# EAGLE design untitled (EAGLE 6.5.0)
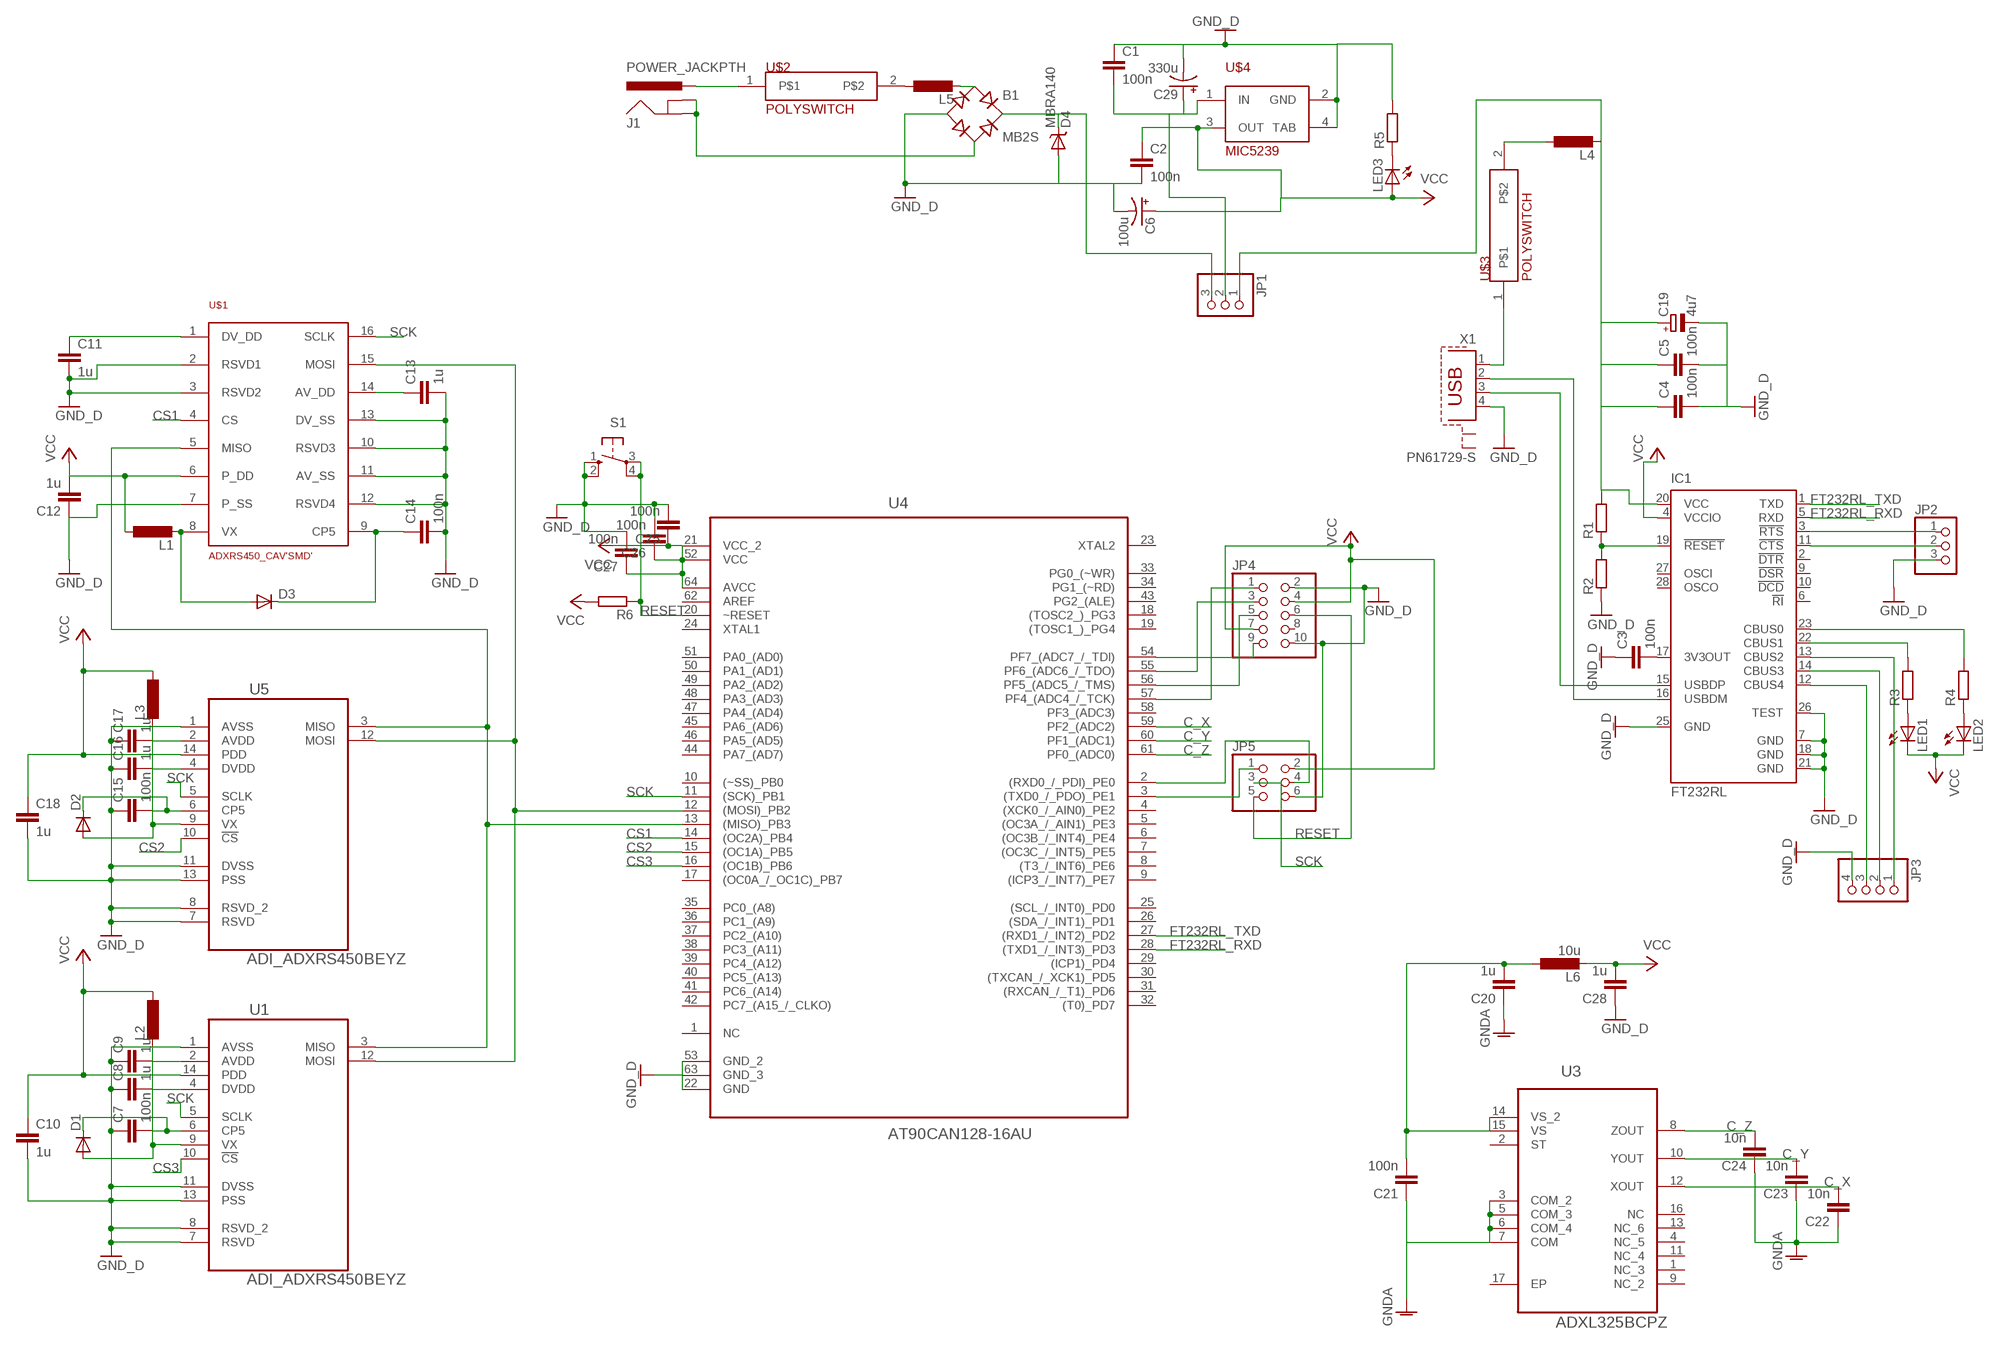
[diagram p0: schematic, sheet 1]

## Parts
B1  MB2S  [SOIC-4]
C1  100n  CAP0603-CAP  [0603-CAP]
C2  100n  CAP0603-CAP  [0603-CAP]
C3  100n  CAP0603-CAP  [0603-CAP]
C4  100n  C-EUC0603  [C0603]
C5  100n  C-EUC0603  [C0603]
C6  100u  CAP_POLG  [PANASONIC_G]
C7  100n  C-EUC0603  [C0603]
C8  1u  C-EUC0603  [C0603]
C9  1u  C-EUC0603  [C0603]
C10  1u  C-EUC0603  [C0603]
C11  1u  C-EUC0603  [C0603]
C12  1u  C-EUC0603  [C0603]
C13  1u  C-EUC0603  [C0603]
C14  100n  C-EUC0603  [C0603]
C15  100n  C-EUC0603  [C0603]
C16  1u  C-EUC0603  [C0603]
C17  1u  C-EUC0603  [C0603]
C18  1u  C-EUC0603  [C0603]
C19  4u7  CPOL-EU153CLV-0405  [153CLV-0405]
C20  1u  C-EUC0603  [C0603]
C21  100n  C-EUC0603  [C0603]
C22  10n  C-EUC0603  [C0603]
C23  10n  C-EUC0603  [C0603]
C24  10n  C-EUC0603  [C0603]
C25  100n  C-EUC0603  [C0603]
C26  100n  C-EUC0603  [C0603]
C27  100n  C-EUC0603  [C0603]
C28  1u  C-EUC0603  [C0603]
C29  330u  CAP_POLG  [PANASONIC_G]
D1  DIODE-SOD123  [SOD123]
D2  DIODE-SOD123  [SOD123]
D3  DIODE-SOD123  [SOD123]
D4  MBRA140  [SMA-DIODE]
IC1  FT232RL  [SSOP28]
J1  POWER_JACKPTH  [POWER_JACK_PTH]
JP1  PINHD-1X3  [1X03]
JP2  PINHD-1X3  [1X03]
JP3  PINHD-1X4  [1X04]
JP4  PINHD-2X5  [2X05]
JP5  PINHD-2X3  [2X03]
L1  L-EUL1812  [L1812]
L2  L-EUL1812  [L1812]
L3  L-EUL1812  [L1812]
L4  L-EUL1812  [L1812]
L5  L-EUL1812  [L1812]
L6  10u  L-EUL1812  [L1812]
LED1  LEDCHIPLED_0603  [CHIPLED_0603]
LED2  LEDCHIPLED_0603  [CHIPLED_0603]
LED3  LEDCHIPLED_0603  [CHIPLED_0603]
R1  R-EU_R0603  [R0603]
R2  R-EU_R0603  [R0603]
R3  R-EU_R0603  [R0603]
R4  R-EU_R0603  [R0603]
R5  R-EU_R0603  [R0603]
R6  R-EU_R0603  [R0603]
S1  10-XX  [B3F-10XX]
U1  ADI_ADXRS450BEYZ  [ADI_ADXRS45XXXX]
U3  ADXL325BCPZ  [QFN65P400X400X150-17N]
U4  AT90CAN128-16AU  [QFP80P1600X1600X120-64N]
U5  ADI_ADXRS450BEYZ  [ADI_ADXRS45XXXX]
U$1  ADXRS450_CAV'SMD'  [SOIC_CAV_16]
U$2  POLYSWITCH  [FUSE]
U$3  POLYSWITCH  [FUSE]
U$4  MIC5239  [SOT-223-3]
X1  PN61729-S  [PN61729-S]

## Nets
C_X: C22.2 U3.12(XOUT) U4.59(PF2_(ADC2))
C_Y: C23.2 U3.10(YOUT) U4.60(PF1_(ADC1))
C_Z: C24.2 U3.8(ZOUT) U4.61(PF0_(ADC0))
CS1: U4.14((OC2A)_PB4) U$1.4(CS)
CS2: U4.15((OC1A)_PB5) U5.10(!CS)
CS3: U1.10(!CS) U4.16((OC1B)_PB6)
FT232RL_RXD: IC1.5(RXD) U4.28((TXD1_/_INT3)_PD3)
FT232RL_TXD: IC1.1(TXD) U4.27((RXD1_/_INT2)_PD2)
GND: B1.- C1.1 C2.2 C3.1 C4.2 C5.2 C6.- C7.1 C8.1 C9.1 C10.2 C11.2 C12.1 C13.2 C14.2 C15.1 C16.1 C17.1 C18.2 C19.- C25.2 C26.2 C27.2 C28.1 C29.- D4.A IC1.7(GND) IC1.18(GND) IC1.21(GND) IC1.25(GND) IC1.26(TEST) JP2.3 JP3.4 JP4.2 JP4.10 JP5.6 R2.1 R5.2 S1.1(S) S1.2(S1) U1.1(AVSS) U1.7(RSVD) U1.8(RSVD_2) U1.11(DVSS) U1.13(PSS) U4.22(GND) U4.53(GND_2) U5.1(AVSS) U5.7(RSVD) U5.8(RSVD_2) U5.11(DVSS) U5.13(PSS) U$1.2(RSVD1) U$1.3(RSVD2) U$1.7(P_SS) U$1.10(RSVD3) U$1.11(AV_SS) U$1.12(RSVD4) U$1.13(DV_SS) U$4.2(GND) U$4.4(TAB) X1.4 ; supply symbol labelled GND_D
GNDA: C20.1 C21.1 C22.1 C23.1 C24.1 U3.3(COM_2) U3.5(COM_3) U3.6(COM_4) U3.7(COM)
N$1: J1.PWR U$2.1
N$2: L5.1 U$2.2
N$3: B1.~2(AC2) J1.GND J1.GNDBREAK
N$4: C1.2 C29.+ JP1.2 U$4.1(IN)
N$5: D3.A L1.2 U$1.8(VX)
N$6: JP4.1 U4.57(PF4_(ADC4_/_TCK))
N$7: JP4.3 U4.55(PF6_(ADC6_/_TDO))
N$8: U$3.1 X1.1
N$9: IC1.16(USBDM) X1.2
N$10: C9.2 U1.2(AVDD)
N$11: C8.2 U1.4(DVDD)
N$12: C7.2 D1.C U1.6(CP5)
N$13: C13.1 U$1.14(AV_DD)
N$14: IC1.15(USBDP) X1.3
N$15: C14.1 D3.C U$1.9(CP5)
N$16: C11.1 U$1.1(DV_DD)
N$17: C3.2 IC1.17(3V3OUT)
N$18: IC1.19(!RESET) R1.1 R2.2
N$19: D1.A L2.2 U1.9(VX)
N$20: B1.+ D4.C JP1.3
N$21: LED1.A R3.1
N$22: LED2.A R4.1
N$23: C17.2 U5.2(AVDD)
N$24: C16.2 U5.4(DVDD)
N$25: C15.2 D2.C U5.6(CP5)
N$26: D2.A L3.2 U5.9(VX)
N$27: IC1.22(CBUS1) R3.2
N$28: IC1.23(CBUS0) R4.2
N$29: L4.1 U$3.2
N$30: IC1.3(!RTS) JP2.1
N$31: IC1.11(!CTS) JP2.2
N$32: IC1.13(CBUS2) JP3.1
N$33: JP5.1 U4.3((TXD0_/_PDO)_PE1)
N$34: IC1.14(CBUS3) JP3.2
N$35: IC1.12(CBUS4) JP3.3
N$36: LED3.C R5.1
N$37: B1.~1(AC1) L5.2
N$38: JP5.4 U4.2((RXD0_/_PDI)_PE0)
N$39: JP4.5 U4.56(PF5_(ADC5_/_TMS))
N$40: C4.1 C5.1 C19.+ IC1.20(VCC) JP1.1 L4.2 R1.2
N$41: U1.12(MOSI) U4.12((MOSI)_PB2) U5.12(MOSI) U$1.15(MOSI)
N$44: JP4.9 U4.54(PF7_(ADC7_/_TDI))
N$46: C20.2 C21.2 L6.1 U3.14(VS_2) U3.15(VS)
N$51: U1.3(MISO) U4.13((MISO)_PB3) U5.3(MISO) U$1.5(MISO)
RESET: JP4.6 JP5.5 R6.1 S1.3(P) S1.4(P1) U4.20(~RESET)
SCK: JP5.3 U1.5(SCLK) U4.11((SCK)_PB1) U5.5(SCLK) U$1.16(SCLK)
VCC: C2.1 C6.+ C10.1 C12.2 C18.1 C25.1 C26.1 C27.1 C28.2 IC1.4(VCCIO) JP4.4 JP4.7 JP5.2 L1.1 L2.1 L3.1 L6.2 LED1.C LED2.C LED3.A R6.2 U1.14(PDD) U4.21(VCC_2) U4.64(AVCC) U5.14(PDD) U$1.6(P_DD) U$4.3(OUT)
Unconnected: IC1.2(!DTR) IC1.6(!RI) IC1.9(!DSR) IC1.10(!DCD) IC1.27(OSCI) IC1.28(OSCO) JP4.8 U3.1(NC_3) U3.2(ST) U3.4(NC_5) U3.9(NC_2) U3.11(NC_4) U3.13(NC_6) U3.16(NC) U3.17(EP) U4.1(NC) U4.4((XCK0_/_AIN0)_PE2) U4.5((OC3A_/_AIN1)_PE3) U4.6((OC3B_/_INT4)_PE4) U4.7((OC3C_/_INT5)_PE5) U4.8((T3_/_INT6)_PE6) U4.9((ICP3_/_INT7)_PE7) U4.10((~SS)_PB0) U4.17((OC0A_/_OC1C)_PB7) U4.18((TOSC2_)_PG3) U4.19((TOSC1_)_PG4) U4.23(XTAL2) U4.24(XTAL1) U4.25((SCL_/_INT0)_PD0) U4.26((SDA_/_INT1)_PD1) U4.29((ICP1)_PD4) U4.30((TXCAN_/_XCK1)_PD5) U4.31((RXCAN_/_T1)_PD6) U4.32((T0)_PD7) U4.33(PG0_(~WR)) U4.34(PG1_(~RD)) U4.35(PC0_(A8)) U4.36(PC1_(A9)) U4.37(PC2_(A10)) U4.38(PC3_(A11)) U4.39(PC4_(A12)) U4.40(PC5_(A13)) U4.41(PC6_(A14)) U4.42(PC7_(A15_/_CLKO)) U4.43(PG2_(ALE)) U4.44(PA7_(AD7)) U4.45(PA6_(AD6)) U4.46(PA5_(AD5)) U4.47(PA4_(AD4)) U4.48(PA3_(AD3)) U4.49(PA2_(AD2)) U4.50(PA1_(AD1)) U4.51(PA0_(AD0)) U4.58(PF3_(ADC3)) U4.62(AREF) U4.63(GND_3) X1.S1 X1.S2

## Power pins joined to a net without a drawn wire
VCC: U4.52(VCC)

## Library data of the parts
B1 = rectifier:MB*S: Bridge Rectifier Source: http://www.fairchildsemi.com/ds/MB/MB6S.pdf
C1-C3 = SparkFun-Capacitors:CAP: Capacitor Standard 0603 ceramic capacitor, and 0.1" leaded capacitor.
C4 C5 C7-C18 C20-C28 = rcl:C-EU: CAPACITOR, European symbol
C6 C29 = SparkFun-Capacitors:CAP_POL: Capacitor Polarized These are standard SMD and PTH capacitors. Normally 10uF, 47uF, and 100uF in electrolytic and tantalum varieties. Always verify the external diameter of the through hole cap, it varies with capacity, voltage, and manufacturer. The EIA devices should be standard.
C19 = resistor:CPOL-EU: POLARIZED CAPACITOR, European symbol
D1-D3 = diode:DIODE-: DIODE
D4 = SparkFun-DiscreteSemi:MBRA140: 40V, 1A Schottky rectifier SMA/DO-214AC package DIO-08053; PROD_ID: DIO-08053
IC1 = ftdichip:FT232R: Source: http://www.ftdichip.com/Documents/DataSheets/DS_FT232R_v104.pdf; MPN: FT232RL; OC_FARNELL: 1146032; OC_NEWARK: 91K9918
J1 = SparkFun-Connectors:POWER_JACK: Power Jack This is the standard 5.5mm barrel jack for power. The PTH is the most common, proven, reliable, footprint. The Slot footprint only works if the mill layer is transmitted to the PCB fab house so be warned. Spark Fun Electronics SKU : PRT-00119 SMT: CONN-08106 Mating wall wart : TOL-00298 (and others)
JP1 JP2 = pinhead:PINHD-1X3: PIN HEADER
JP3 = pinhead:PINHD-1X4: PIN HEADER
JP4 = pinhead:PINHD-2X5: PIN HEADER
JP5 = pinhead:PINHD-2X3: PIN HEADER
L1-L6 = rcl:L-EU: INDUCTOR, European symbol
LED1-LED3 = led:LED: LED OSRAM: - CHIPLED LG R971, LG N971, LY N971, LG Q971, LY Q971, LO R971, LY R971 LH N974, LH R974 LS Q976, LO Q976, LY Q976 LO Q996 - Hyper CHIPLED LW Q18S LB Q993, LB Q99A, LB R99A - SideLED LS A670, LO A670, LY A670, LG A670, LP A670 LB A673, LV A673, LT A673, LW A673 LH A674 LY A675 LS A676, LA A676, LO A676, LY A676, LW A676 LS A679, LY A679, LG A679 - Hyper Micro SIDELED® LS Y876, LA Y876, LO Y876, LY Y876 LT Y87S - SmartLED LW L88C, LW L88S LB L89C, LB L89S, LG L890 LS L89K, LO L89K, LY L89K LS L896, LA L896, LO L896, LY L896 - TOPLED LS T670, LO T670, LY T670, LG T670, LP T670 LSG T670, LSP T670, LSY T670, LOP T670, LYG T670 LG T671, LOG T671, LSG T671 LB T673, LV T673, LT T673, LW T673 LH T674 LS T676, LA T676, LO T676, LY T676, LB T676, LH T676, LSB T676, LW T676 LB T67C, LV T67C, LT T67C, LS T67K, LO T67K, LY T67K, LW E67C LS E67B, LA E67B, LO E67B, LY E67B, LB E67C, LV E67C, LT E67C LW T67C LS T679, LY T679, LG T679 LS T770, LO T770, LY T770, LG T770, LP T770 LB T773, LV T773, LT T773, LW T773 LH T774 LS E675, LA E675, LY E675, LS T675 LS T776, LA T776, LO T776, LY T776, LB T776 LHGB T686 LT T68C, LB T68C - Hyper Mini TOPLED® LB M676 - Mini TOPLED Santana® LG M470 LS M47K, LO M47K, LY M47K Source: http://www.osram.convergy.de LUXEON: - LUMILED® LXK2-PW12-R00, LXK2-PW12-S00, LXK2-PW14-U00, LXK2-PW14-V00 LXK2-PM12-R00, LXK2-PM12-S00, LXK2-PM14-U00 LXK2-PE12-Q00, LXK2-PE12-R00, LXK2-PE12-S00, LXK2-PE14-T00, LXK2-PE14-U00 LXK2-PB12-K00, LXK2-PB12-L00, LXK2-PB12-M00, LXK2-PB14-N00, LXK2-PB14-P00, LXK2-PB14-Q00 LXK2-PR12-L00, LXK2-PR12-M00, LXK2-PR14-Q00, LXK2-PR14-R00 LXK2-PD12-Q00, LXK2-PD12-R00, LXK2-PD12-S00 LXK2-PH12-R00, LXK2-PH12-S00 LXK2-PL12-P00, LXK2-PL12-Q00, LXK2-PL12-R00 Source: www.luxeon.com KINGBRIGHT: KA-3528ASYC Source: www.kingbright.com
R1-R6 = rcl:R-EU_: RESISTOR, European symbol
S1 = switch-omron:10-XX: OMRON SWITCH; MPN: B3F-1000; OC_FARNELL: 176432; OC_NEWARK: 36M3542
U1 U5 = ADI-ADL5324_ADXRS45xx:ADI_ADXRS: GYROSCOPE, 300 DEG/SEC, 14LCC; MPN: ADXRS450BEYZ; OC_FARNELL: 1897080; OC_NEWARK: 31T9300; PACKAGE: 14LCC; SUPPLIER: ANALOG DEVICES
U3 = ADXL325:ADXL325BCPZ: Small, Low Power, 3-Axis ±5 g Accelerometer; MPN: ADXL325BCPZ; OC_FARNELL: 1786063; OC_NEWARK: 05R6561; PACKAGE: LFCSP-16; SUPPLIER: Analog Devices
U4 = AT90CAN128:AT90CAN128-16AU: CAN Controller; MPN: AT90CAN128-16AU; OC_FARNELL: 1455065; OC_NEWARK: 58M3860; PACKAGE: TQFP-64; SUPPLIER: Atmel
U$1 = ADXRS450_SOIC:ADXRS450_CAV
U$2 U$3 = POLYSWITCH:POLYSWITCH
U$4 = MIC5239-3.3:MIC5239
X1 = con-berg:PN61729-S: BERG USB connector; OC_FARNELL: unknown; OC_NEWARK: unknown

## Board
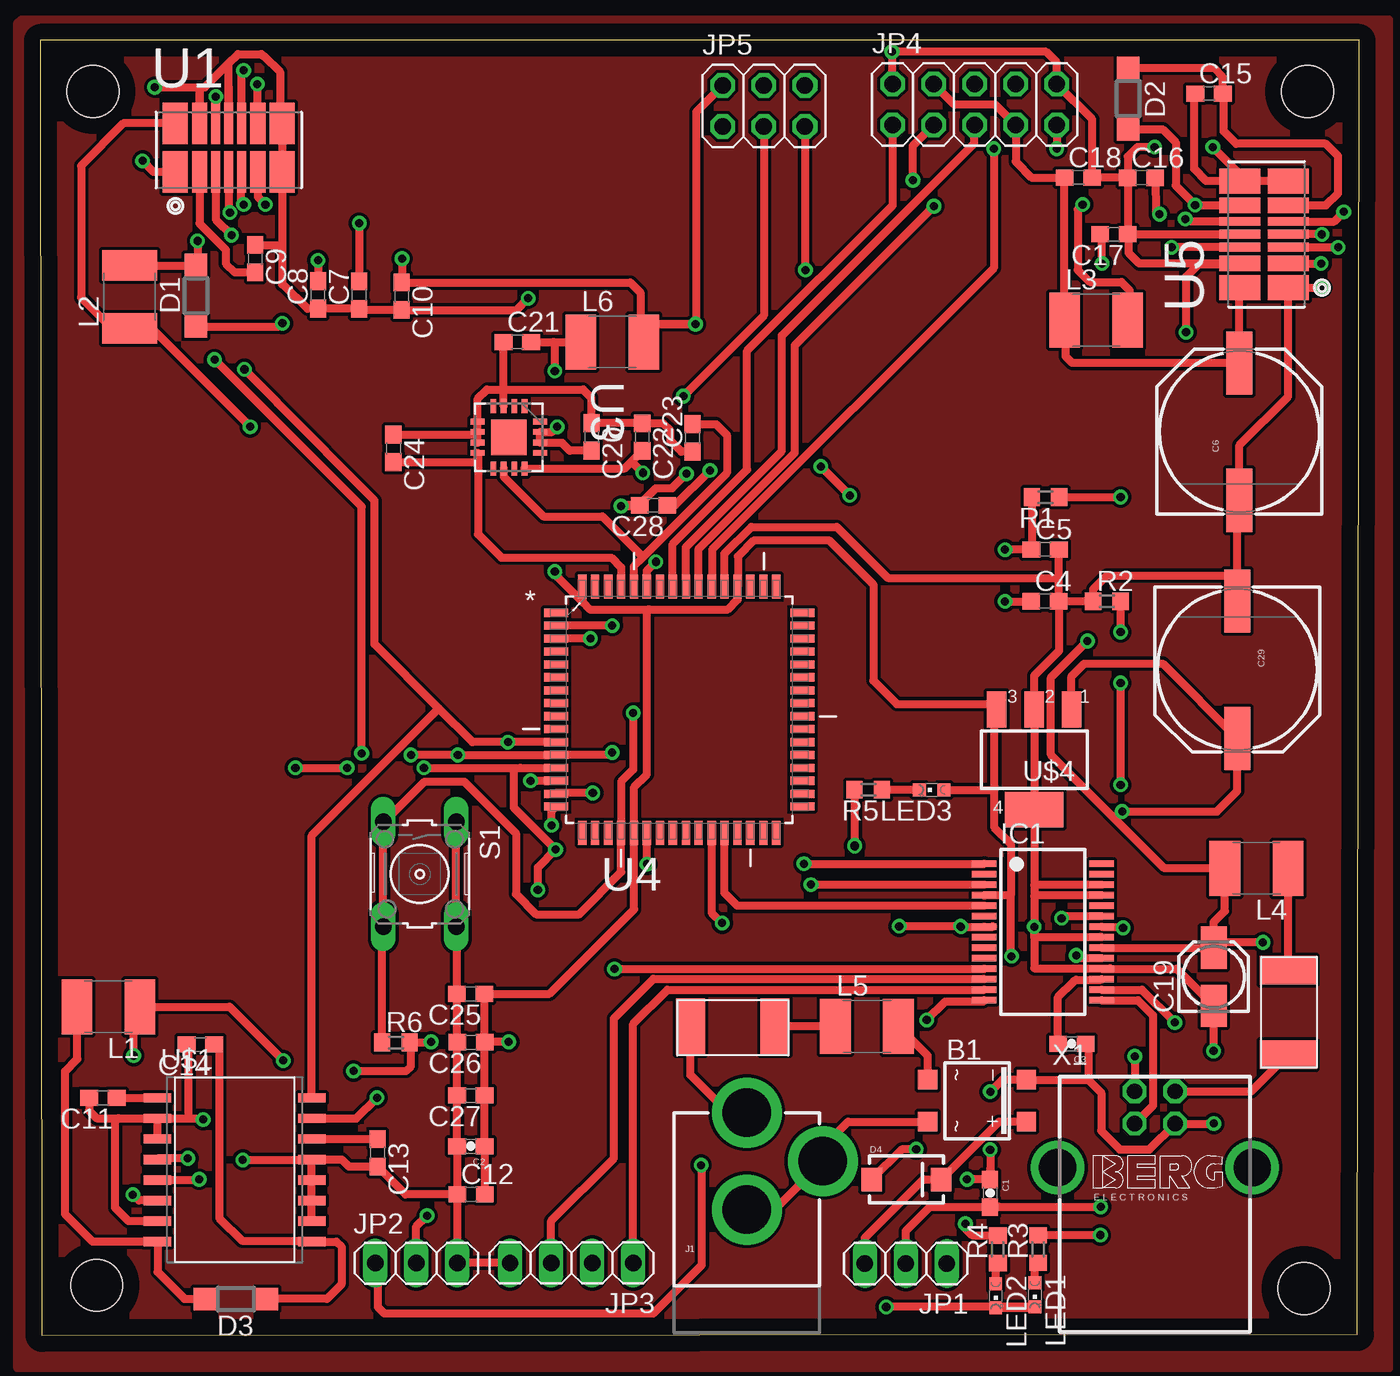
[diagram p1: board, top side]
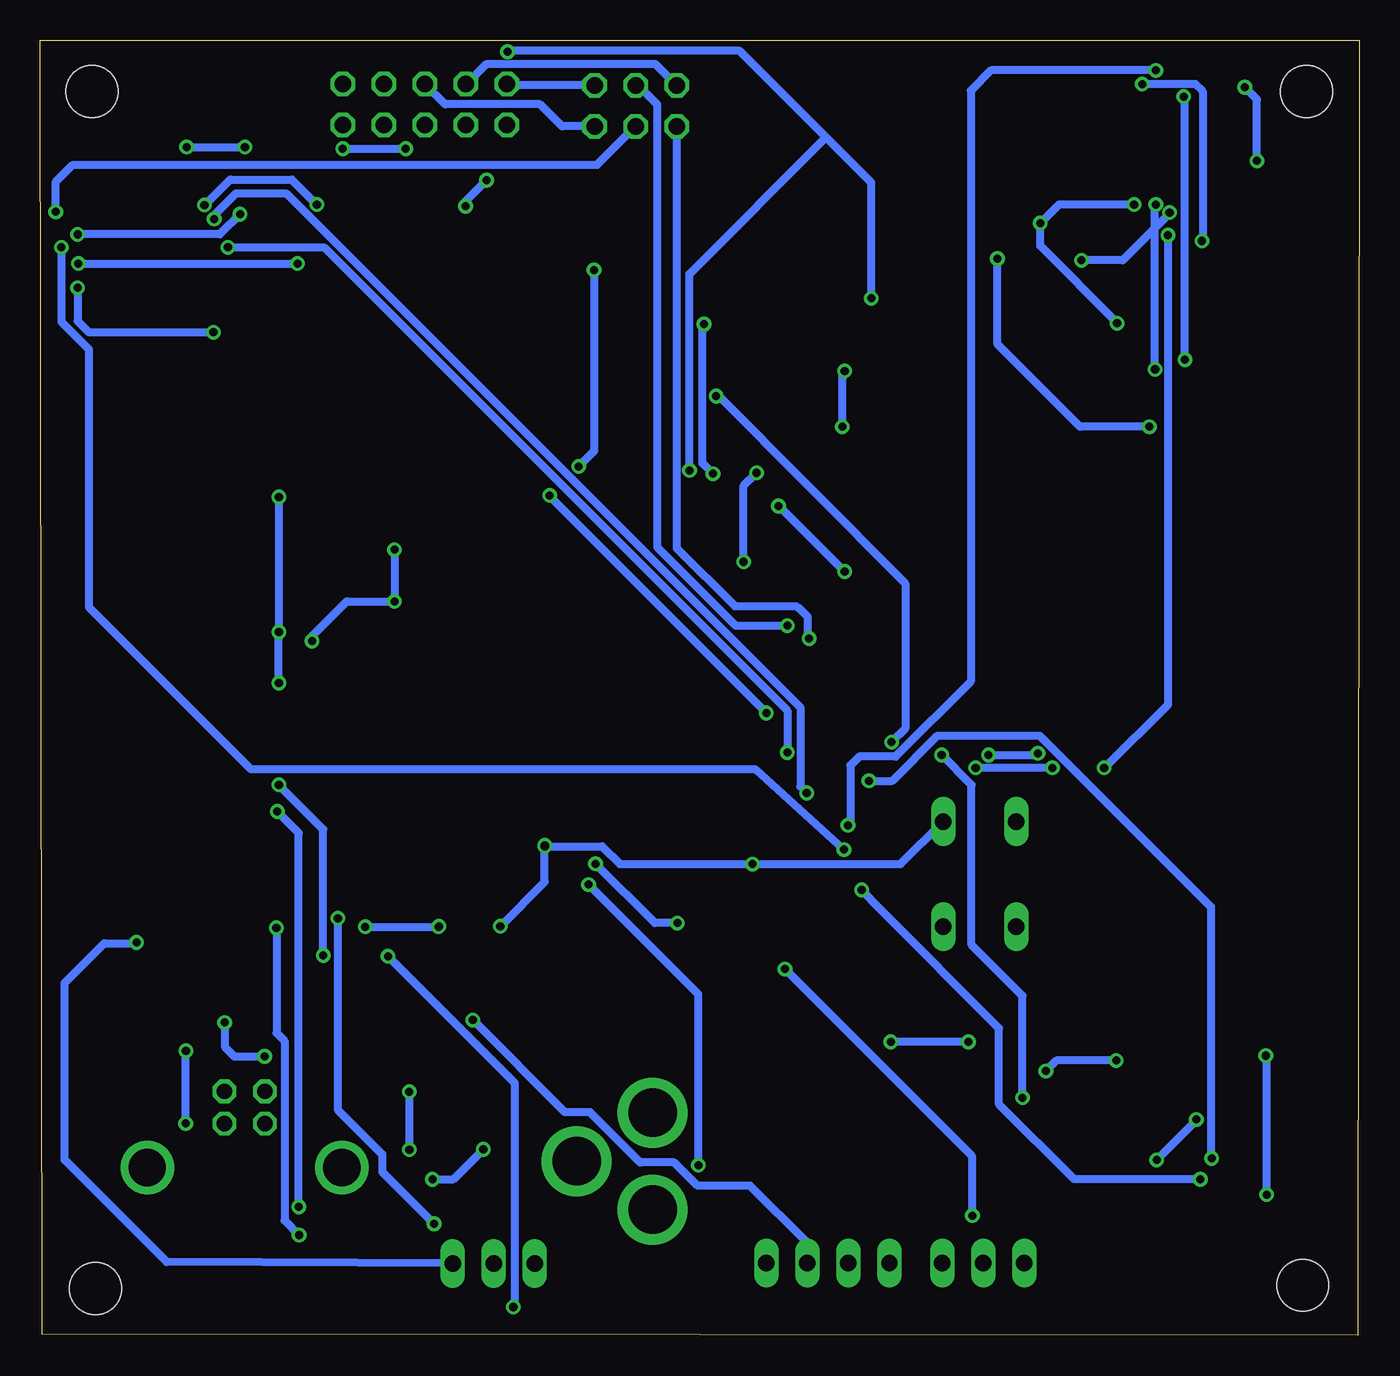
[diagram p2: board, bottom side, seen from below]

Size 81.57 x 80.11 mm. Coordinates in mm from the lower left corner, seen from the top.
Outline: 0.08,0 81.47,0.06 81.57,80.11 0,80.11 0.08,0
Copper layers (1*16): Top 0.035mm / dielectric 1.5mm / Bottom 0.035mm
Design rules "default": minimum track width 10mil, minimum drill 24mil, track to track 8mil, track to pad 8mil, pad to pad 8mil, via to via 8mil, smd to smd 8mil, copper to edge 40mil, drill to drill 8mil, minimum pad ring 10mil, minimum via ring 8mil, stop-mask expansion 4mil, vias tented up to drill 0mil, thermal gap 10mil
Holes 3.2 mm at 3.48,3.1 78.17,2.91 3.25,76.96 78.37,76.96

### Footprints (pad centres in the part's own frame; a part is rotated, then mirrored left to right if it is on the bottom)
SOIC-4 = smd 1.2 x 1.2: + 1.3,3.05; - -1.3,3.05; ~1 -1.3,-3.05; ~2 1.3,-3.05
0603-CAP = smd 1.1 x 1: 1 -0.85,0; 2 0.85,0
C0603 = smd 1.1 x 1: 1 -0.85,0; 2 0.85,0
PANASONIC_G = smd 3.9 x 1.6: + 4.25,0; - -4.25,0
153CLV-0405 = smd 2.6 x 1.6: + 1.8,0; - -1.8,0
SOD123 = smd 1.4 x 1.4: A 1.9,0; C -1.9,0
SMA-DIODE = smd 1.27 x 1.47: A -2.15,0; C 2.15,0
SSOP28 = smd 0.4 x 1.5: 1 -4.225,-3.625; 2 -3.575,-3.625; 3 -2.925,-3.625; 4 -2.275,-3.625; 5 -1.625,-3.625; 6 -0.975,-3.625; 7 -0.325,-3.625; 8 0.325,-3.625; 9 0.975,-3.625; 10 1.625,-3.625; 11 2.275,-3.625; 12 2.925,-3.625; 13 3.575,-3.625; 14 4.225,-3.625; 15 4.225,3.625; 16 3.575,3.625; 17 2.925,3.625; 18 2.275,3.625; 19 1.625,3.625; 20 0.975,3.625; 21 0.325,3.625; 22 -0.325,3.625; 23 -0.975,3.625; 24 -1.625,3.625; 25 -2.275,3.625; 26 -2.925,3.625; 27 -3.575,3.625; 28 -4.225,3.625
POWER_JACK_PTH = drill 2.997 pad 4.318: GND 0,7.7; GNDBREAK 4.7,10.7; PWR 0,13.7
1X03 = drill 1.016 long: 1 -2.54,0; 2 0,0; 3 2.54,0
1X04 = drill 1.016 long: 1 -3.81,0; 2 -1.27,0; 3 1.27,0; 4 3.81,0
2X05 = drill 1.016 octagon: 1 -5.08,-1.27; 2 -5.08,1.27; 3 -2.54,-1.27; 4 -2.54,1.27; 5 0,-1.27; 6 0,1.27; 7 2.54,-1.27; 8 2.54,1.27; 9 5.08,-1.27; 10 5.08,1.27
2X03 = drill 1.016 octagon: 1 -2.54,-1.27; 2 -2.54,1.27; 3 0,-1.27; 4 0,1.27; 5 2.54,-1.27; 6 2.54,1.27
L1812 = smd 1.9 x 3.4: 1 -1.95,0; 2 1.95,0
CHIPLED_0603 = smd 0.8 x 0.8: A 0,-0.75; C 0,0.75
R0603 = smd 1 x 1.1: 1 -0.85,0; 2 0.85,0
B3F-10XX = drill 1.016 long: 1 -3.251,2.261; 2 3.251,2.261; 3 -3.251,-2.261; 4 3.251,-2.261
ADI_ADXRS45XXXX = smd 1.55 x 2.55: 1 -3.3,-1.5; 7 3.3,-1.5; 8 3.3,1.5; 14 -3.3,1.5 | smd 0.95 x 2.55: 2 -1.8,-1.5; 6 1.8,-1.5; 9 1.8,1.5; 13 -1.8,1.5 | smd 0.55 x 2.55: 3 -0.8,-1.5; 4 0,-1.5; 5 0.8,-1.5; 10 0.8,1.5; 11 0,1.5; 12 -0.8,1.5
QFN65P400X400X150-17N = smd 0.864 x 0.356: 1 -1.93,0.965; 2 -1.93,0.33; 3 -1.93,-0.33; 4 -1.93,-0.965; 9 1.93,-0.965; 10 1.93,-0.33; 11 1.93,0.33; 12 1.93,0.965 | smd 0.356 x 0.864: 5 -0.965,-1.93; 6 -0.33,-1.93; 7 0.33,-1.93; 8 0.965,-1.93; 13 0.965,1.93; 14 0.33,1.93; 15 -0.33,1.93; 16 -0.965,1.93 | smd 2.21 x 2.21: 17 0,0
QFP80P1600X1600X120-64N = smd 1.473 x 0.508: 1 -7.62,5.994; 2 -7.62,5.207; 3 -7.62,4.394; 4 -7.62,3.607; 5 -7.62,2.794; 6 -7.62,2.007; 7 -7.62,1.194; 8 -7.62,0.406; 9 -7.62,-0.406; 10 -7.62,-1.194; 11 -7.62,-2.007; 12 -7.62,-2.794; 13 -7.62,-3.607; 14 -7.62,-4.394; 15 -7.62,-5.207; 16 -7.62,-5.994; 33 7.62,-5.994; 34 7.62,-5.207; 35 7.62,-4.394; 36 7.62,-3.607; 37 7.62,-2.794; 38 7.62,-2.007; 39 7.62,-1.194; 40 7.62,-0.406; 41 7.62,0.406; 42 7.62,1.194; 43 7.62,2.007; 44 7.62,2.794; 45 7.62,3.607; 46 7.62,4.394; 47 7.62,5.207; 48 7.62,5.994 | smd 0.508 x 1.473: 17 -5.994,-7.62; 18 -5.207,-7.62; 19 -4.394,-7.62; 20 -3.607,-7.62; 21 -2.794,-7.62; 22 -2.007,-7.62; 23 -1.194,-7.62; 24 -0.406,-7.62; 25 0.406,-7.62; 26 1.194,-7.62; 27 2.007,-7.62; 28 2.794,-7.62; 29 3.607,-7.62; 30 4.394,-7.62; 31 5.207,-7.62; 32 5.994,-7.62; 49 5.994,7.62; 50 5.207,7.62; 51 4.394,7.62; 52 3.607,7.62; 53 2.794,7.62; 54 2.007,7.62; 55 1.194,7.62; 56 0.406,7.62; 57 -0.406,7.62; 58 -1.194,7.62; 59 -2.007,7.62; 60 -2.794,7.62; 61 -3.607,7.62; 62 -4.394,7.62; 63 -5.207,7.62; 64 -5.994,7.62
SOIC_CAV_16 = smd 1.691 x 0.572: 1 -4.771,5.08; 2 -4.771,3.81; 3 -4.771,2.54; 4 -4.771,1.27; 5 -4.771,0; 6 -4.771,-1.27; 7 -4.771,-2.54; 8 -4.771,-3.81; 9 4.771,-3.81; 10 4.771,-2.54; 11 4.771,-1.27; 12 4.771,0; 13 4.771,1.27; 14 4.771,2.54; 15 4.771,3.81; 16 4.771,5.08
FUSE = smd 1.78 x 3.5: 1 2.615,0; 2 -2.615,0
SOT-223-3 = smd 1.219 x 2.235: 1 -2.311,-3.099; 2 0,-3.099; 3 2.311,-3.099 | smd 3.6 x 2.2: 4 0,3.099
PN61729-S = drill 0.95 octagon: 1 1.25,4.71; 2 -1.25,4.71; 3 -1.25,2.71; 4 1.25,2.71 | drill 2.3 pad 2.9: S1 -6.02,0; S2 6.02,0

### Placement (x,y rotation side)
B1  57.94,14.52 270 top
C1  58.74,8.79 270 top
C2  26.63,11.71 180 top
C3  63.8,18.04 180 top
C4  62.14,45.41 0 top
C5  62.16,48.62 0 top
C6  74.17,55.91 90 top
C7  19.72,64.35 90 top
C8  17.17,64.36 90 top
C9  13.29,66.6 270 top
C10  22.35,64.29 270 top
C11  3.86,14.7 180 top
C12  26.64,8.72 0 top
C13  20.86,11.29 270 top
C14  9.89,18 180 top
C15  72.29,76.82 0 top
C16  68.11,71.6 0 top
C17  66.39,68.11 180 top
C18  64.21,71.62 0 top
C19  72.58,22.18 90 top
C20  34.09,55.58 270 top
C21  29.49,61.45 0 top
C22  37.23,55.57 270 top
C23  40.34,55.52 90 top
C24  21.84,54.88 270 top
C25  26.62,21.12 180 top
C26  26.63,18.14 180 top
C27  26.62,14.84 180 top
C28  37.92,51.35 180 top
C29  74.04,41.19 270 top
D1  9.63,64.31 90 top
D2  67.29,76.51 270 top
D3  12.09,2.25 180 top
D4  53.57,9.64 0 top
IC1  62.01,24.95 270 top
J1  43.7,0.07 0 top
JP1  53.53,4.44 180 top
JP2  23.25,4.47 0 top
JP3  32.86,4.48 180 top
JP4  57.79,76.14 0 top
JP5  44.75,76.06 0 top
L1  4.21,20.33 180 top
L2  5.51,64.24 90 top
L3  65.3,62.8 0 top
L4  75.22,28.89 180 top
L5  51.13,19.11 0 top
L6  35.37,61.45 0 top
LED1  61.5,2.51 180 top
LED2  59.09,2.45 180 top
LED3  55.14,33.75 90 top
R1  62.17,51.85 180 top
R2  65.97,45.42 0 top
R3  61.72,5.33 90 top
R4  59.22,5.32 90 top
R5  51.21,33.76 180 top
R6  21.99,18.12 0 top
S1  23.47,28.54 270 top
U1  11.65,73.47 0 top
U3  28.98,55.56 270 top
U4  39.52,38.7 0 top
U5  75.69,68.11 90 top
U$1  12.02,9.61 0 top
U$2  42.83,19.09 180 top
U$3  77.18,19.98 270 top
U$4  61.47,35.62 180 top
X1  68.94,10.38 0 top

### Tracks (layer width: path | path; a pad name or v marks a point on that pad's centre or on a via)
C_X  (via drill 0.5 pad 0.25)
  Top 0.5: U3.12 36.14,53.63 36.57,54.06 | 36.57,54.06 C22.2 | U4.59 37.51,47.3 v38.07,47.85 | v37.27,53.35 36.57,54.06
  Bottom 0.5: v38.07,47.85 38.07,52.55 v37.27,53.35
C_Y
  Top 0.5: U4.60 36.73,47.61 37.27,48.16 | 37.27,48.16 42.47,53.35 42.47,55.7 41.8,56.37 C23.2 | U3.10 28.65,53.12 31.12,50.66 34.77,50.66 37.27,48.16
C_Z
  Top 0.5: C24.2 27.05,54.02 U3.8 27.07,54.59 27.07,49.55 28.52,48.1 35.32,48.1 35.92,47.51 U4.61
CS1  (via drill 0.5 pad 0.25)
  Top 0.5: U4.14 v30.33,34.31 v30.32,34.3 | v9.12,10.96 7.32,10.96 U$1.4
  Bottom 0.5: v30.32,34.3 28.87,34.3 26.07,37.1 19.77,37.1 9.17,26.5 9.17,11 v9.12,10.96
CS2  (via drill 0.5 pad 0.25)
  Top 0.5: U5.10 70.97,68.91 v70.82,69.06 | v34.17,33.55 31.96,33.55 U4.15
  Bottom 0.5: v70.82,69.06 70.82,69.31 69.47,70.66 66.37,70.66 34.57,38.85 34.57,33.95 v34.17,33.55
CS3  (via drill 0.5 pad 0.25)
  Top 0.5: U1.10 12.45,78.13 v12.57,78.26 | v31.62,31.55 31.62,32.43 U4.16
  Bottom 0.5: v12.57,78.26 22.77,78.26 24.02,77.01 24.02,40.45 28.67,35.8 30.92,35.8 31.47,35.26 31.47,31.7 v31.62,31.55
FT232RL_RXD
  Top 0.5: IC1.5 43.12,26.58 42.31,27.38 U4.28
FT232RL_TXD  (via drill 0.5 pad 0.25)
  Top 0.5: U4.27 41.53,26.15 v42.17,25.5 | v47.23,29.18 IC1.1
  Bottom 0.5: v42.17,25.5 43.56,25.5 v47.23,29.18
GND  (via drill 0.5 pad 0.25)
  Top 0.5: v72.58,13.11 v72.58,13.09 X1.4 68.6,11.5 66.77,11.5 65.62,12.65 65.62,15 64.81,15.81 | v72.57,17.61 C19.- 70.28,22.68 66.17,22.68 | IC1.18 66.17,22.68 | v58.75,15.07 59.5,15.81 B1.- 64.81,15.81 | v58.75,11.48 58.75,10.3 C1.1 57.33,9.64 v57.32,9.65 | v54.17,11.5 53.28,11.5 D4.A | C29.- 74.04,47.01 | 74.04,47.01 74.04,51.52 C6.- 74.17,55.07 77.18,58.08 U5.1 v79.27,64.81 | JP3.4 JP2.3 | JP2.3 | U$1.13 18.64,10.88 19.07,10.45 C13.2 22.58,8.72 C12.1 | JP2.3 C12.1 | C11.2 3.02,13.89 3.48,13.43 4.82,13.43 | 4.82,13.43 U$1.2 | C12.1 25.8,11.69 C2.2 C27.2 25.77,18.13 C26.2 25.78,21.11 C25.2 25.77,25.25 S1.2 S1.1 | U5.7 U5.8 | v70.87,62.05 70.87,65.51 71.64,66.28 74.16,66.28 U5.13 67.97,66.31 67.32,66.96 67.32,68.04 C17.1 | C16.1 65.08,71.6 C18.2 65.06,75.22 JP4.10 62.87,78.76 62.22,79.41 v52.67,79.41 52.67,77.45 JP4.2 | C16.1 67.25,68.32 C17.1 | C17.1 U5.11 | U5.8 72.12,71.41 71.37,72.16 71.37,76.75 C15.1 | U5.8 74.19,71.84 v72.52,73.51 | v68.92,73.51 67.86,73.51 67.27,72.92 C16.1 | C3.1 64.81,18.04 64.81,15.81 | C4.2 63.02,45.38 63.02,42.35 61.47,40.8 U$4.2 U$4.4 61.47,27.86 | C4.2 62.99,46.76 | 62.99,46.76 62.99,48.6 C5.2 | C4.2 R2.1 65.12,46.16 65.97,47.01 74.04,47.01 | U4.53 42.31,48.35 43.97,50.01 49.27,50.01 52.42,46.85 62.89,46.85 62.99,46.76 | U$1.7 5.45,7.07 4.62,7.9 4.62,13.23 4.82,13.43 | U$1.3 U$1.2 | U$1.2 9.17,13.42 | 9.17,13.42 9.17,17.88 C14.2 | 58.89,25.3 58.92,25.28 IC1.7 v56.94,25.28 | v50.37,30.3 R5.2 v50.36,30.27 v50.37,30.25 | v37.52,29.16 U4.22 | 61.47,27.86 61.47,27.16 | 61.47,27.16 61.47,25.43 v61.47,25.28 61.47,25 | 65.61,24.66 IC1.21 61.47,24.63 61.47,25 | IC1.26 61.5,27.88 61.47,27.86
  Top 0.5: IC1.25 61.55,27.23 61.47,27.16 | 61.47,25 61.47,22.7 66.17,22.7 66.17,22.68 | U$1.10 U$1.11 U$1.12 U$1.13 | 9.17,13.42 10,13.42 v10.07,13.36 | v12.52,10.86 16.76,10.86 U$1.13 | 14.95,67.41 U1.7 U1.8 14.82,75.1 14.82,78.16 13.82,79.16 13.77,79.16 13.67,79.26 12.22,79.26 11.65,78.68 | 14.95,67.41 14.95,65.01 15.02,65.01 16.52,63.51 C8.1 17.18,63.5 C7.1 19.78,63.44 C10.2 29.45,63.44 v30.17,64.16 | 14.95,67.41 13.33,67.41 C9.1 | U1.1 7.01,71.97 v6.32,72.66 | 11.65,77.21 U1.11 11.65,78.68 | v7.07,77.21 9.82,77.21 9.82,75 U1.13 9.87,74.97 9.87,77.21 10.17,77.21 11.65,78.68 | C28.1 39.27,51.35 v41.42,53.51 | v56.92,25.3 v53.12,25.3
  Bottom 0.5: v72.58,13.11 72.58,17.59 v72.57,17.61 | v58.75,15.07 v58.75,11.49 v58.75,11.48 | v57.32,9.65 56.02,9.65 v54.17,11.5 | v79.27,64.81 79.27,62.76 78.57,62.05 v70.87,62.05 | v72.52,73.51 v68.92,73.51 | JP5.6 52.62,77.33 JP4.2 | v53.12,25.3 50.37,28.05 v50.37,30.25 | v50.37,30.25 v50.37,30.3 | v50.37,30.25 46.82,30.25 45.72,29.16 v37.52,29.16 28.36,29.16 S1.1 | v10.07,13.36 10.07,13.3 v12.52,10.86 | v6.32,72.66 6.32,76.46 v7.07,77.21 | v30.17,64.16 30.17,71.31 32.97,74.11 | 32.97,74.11 38.32,79.46 52.62,79.46 v52.67,79.41 | 32.97,74.11 41.42,65.66 v41.42,53.51 | v61.47,25.28 v56.94,25.28 v56.92,25.3
  cutout Bottom: -0.25,80.56 -0.37,-0.45 82.07,-0.4 82.07,80.56
GND_A
  pour Top: 34.87,45.1 34.92,45.1 34.92,47.16 25.57,47.16 25.57,52.85 19.97,52.85 19.97,52.95 19.97,57.3 25.47,57.3 25.47,57.41 25.47,60.85 27.82,63.2 31.37,63.2 32.52,64.36 42.62,64.36 42.62,52.41 42.62,49.2 38.42,45.01 34.97,45.01 34.92,44.95
GNDA
  Top 0.5: C24.1 26.89,55.73 U3.6 | U3.6 U3.5 27.05,57.94 27.62,58.51 28.62,58.51 | U3.7 U3.6 | 28.62,58.51 28.62,57.52 U3.3 | U3.3 28.65,61.44 C21.1 | U3.3 28.65,58.47 28.62,58.51 | C23.1 39.66,54.67 38.97,55.35 38.97,55.95 38.52,56.41 37.24,56.41 C22.1 34.1,56.42 C20.1 34.07,56.45 34.07,58.01 33.57,58.51 28.62,58.51
N$1
  Top 0.5: J1.PWR 42.55,13.78 40.21,16.11 U$2.1
N$2
  Top 0.5: L5.1 45.46,19.11 U$2.2
N$3
  Top 0.5: B1.~2 49.97,13.22 48.4,11.66 J1.GNDBREAK 45.4,7.77 J1.GND
N$4  (via drill 0.5 pad 0.25)
  Top 0.5: C1.2 59.27,7.94 | 59.27,7.94 65.53,7.94 v65.59,7.96 | v66.92,32.41 72.77,32.41 74.03,33.67 C29.+ 69.42,41.55 64.57,41.55 63.78,40.77 U$4.1 | JP1.2 53.53,6.46 55.02,7.96 59.26,7.96 59.27,7.94
  Bottom 0.5: v65.59,7.96 65.59,31.07 v66.92,32.41
N$5
  Top 0.5: L1.2 2.28,20.31 2.28,17.09 1.52,16.34 1.52,7.5 3.22,5.8 U$1.8 7.24,3.93 8.92,2.26 D3.A
N$6
  Top 0.5: U4.57 39.11,48.95 43.72,53.55 43.72,60.91 52.72,69.91 JP4.1
N$7  (via drill 0.5 pad 0.25)
  Top 0.5: U4.55 40.71,48.65 46.67,54.6 46.67,61.26 v55.27,69.86 | v53.97,71.46 53.97,73.59 JP4.3
  Bottom 0.5: v55.27,69.86 55.27,70.16 v53.97,71.46
N$8
  Top 0.5: X1.1 74.9,15.09 U$3.1
N$9  (via drill 0.5 pad 0.25)
  Top 0.5: IC1.16 68.14,21.38 v70.17,19.36 | v67.69,17.27 X1.2
  Bottom 0.5: v70.17,19.36 70.17,17.86 69.57,17.25 67.7,17.25 v67.69,17.27
N$10
  Top 0.5: U1.2 9.85,68.78 11.47,67.16 11.47,66.31 12.02,65.76 C9.2
N$11  (via drill 0.5 pad 0.25)
  Top 0.5: U1.4 11.65,69.53 v11.72,69.46 | v17.17,66.51 C8.2
  Bottom 0.5: v11.72,69.46 11.72,69.41 14.62,66.51 v17.17,66.51
N$12  (via drill 0.5 pad 0.25)
  Top 0.5: U1.6 13.45,70.43 v13.92,69.96 | v19.72,68.81 C7.2 | D1.C 14.77,62.41 v14.97,62.6
  Bottom 0.5: v13.92,69.96 18.57,69.96 v19.72,68.81 19.72,67.41 14.97,62.66 v14.97,62.6
N$13
  Top 0.5: U$1.14 C13.1
N$14
  Top 0.5: X1.3 67.71,13.09 68.82,14.21 68.81,14.21 68.81,19.8 67.89,20.73 IC1.15
N$15
  Top 0.5: D3.C 14,2.26 17.73,2.26 18.62,3.16 18.62,5.5 18.32,5.8 U$1.9 16.73,5.85 12.47,5.85 11.07,7.25 11.07,18 11.06,18 C14.1
N$16
  Top 0.5: C11.1 U$1.1
N$17
  Top 0.5: C3.2 62.95,20.93 63.92,21.91 63.97,21.91 64.07,22 65.61,22 IC1.17
N$18  (via drill 0.5 pad 0.25)
  Top 0.5: IC1.19 64.25,23.33 v64.07,23.5 | v66.82,34.05 v66.82,40.35 | v66.82,43.51 R2.2 | R1.1 v66.82,51.85
  Bottom 0.5: v64.07,23.5 64.07,31.3 v66.82,34.05 | v66.82,40.35 v66.82,43.51 v66.82,51.85
N$19  (via drill 0.5 pad 0.25)
  Top 0.5: L2.2 9.61,66.19 D1.A 9.72,66.3 v9.72,67.71 | U1.9 13.45,77.38 v13.42,77.41
  Bottom 0.5: 9.77,67.76 v9.72,67.71 9.67,67.76 9.67,76.96 10.12,77.41 v13.42,77.41
N$20
  Top 0.5: B1.+ 59.29,13.21 D4.C 54.62,9.65 50.99,6.02 JP1.3
N$21
  Top 0.5: LED1.A 61.5,4.27 R3.1
N$22
  Top 0.5: LED2.A 59.09,4.34 R4.1
N$23  (via drill 0.5 pad 0.25)
  Top 0.5: U5.2 v79.22,66.31 | v65.67,66.31 65.67,67.99 C17.2
  Bottom 0.5: v79.22,66.31 v65.67,66.31
N$24  (via drill 0.5 pad 0.25)
  Top 0.5: C16.2 69,69.42 v69.22,69.36 | v79.27,68.11 U5.4
  Bottom 0.5: v69.22,69.36 70.47,68.11 v79.27,68.11
N$25
  Top 0.5: U5.6 79.52,69.91 80.27,70.66 80.27,72.96 79.52,73.71 73.97,73.71 73.2,74.48 73.2,76.76 C15.2 73.12,76.84 73.12,77.86 72.57,78.41 D2.C
N$26  (via drill 0.5 pad 0.25)
  Top 0.5: D2.A 69.42,74.61 70.22,73.81 70.22,71.12 v71.42,69.92 74.17,69.92 U5.9 | v64.47,69.96 64.17,69.66 64.17,65.91 64.92,65.16 66.87,65.16 67.37,64.66 67.37,62.91 L3.2
  Bottom 0.5: v71.42,69.92 71.41,69.92 69.82,71.51 66.02,71.51 v64.47,69.96
N$27  (via drill 0.5 pad 0.25)
  Top 0.5: IC1.22 66.89,25.28 v66.97,25.2 | v65.57,6.21 61.74,6.21 R3.2
  Bottom 0.5: v66.97,25.2 66.97,18.7 66.47,18.2 66.47,7.1 v65.57,6.21
N$28  (via drill 0.5 pad 0.25)
  Top 0.5: IC1.23 63.3,25.93 v63.17,25.8 | v57.22,6.9 57.22,6.6 57.62,6.21 59.19,6.21 R4.2
  Bottom 0.5: v63.17,25.8 63.17,13.96 60.42,11.21 60.42,10.11 v57.22,6.9
N$29
  Top 0.5: U$3.2 L4.1
N$30  (via drill 0.5 pad 0.25)
  Top 0.5: JP2.1 20.79,4.47 20.87,4.55 20.87,1.75 21.27,1.35 37.92,1.35 40.92,4.35 40.92,10.48 v40.87,10.53 | v47.66,27.89 58.38,27.89 IC1.3
  Bottom 0.5: v40.87,10.53 40.87,21.09 v47.66,27.89
N$31  (via drill 0.5 pad 0.25)
  Top 0.5: JP2.2 23.25,6.73 v23.92,7.4 | v35.52,22.66 58.37,22.66 IC1.11
  Bottom 0.5: v23.92,7.4 23.92,11.07 v35.52,22.66
N$32
  Top 0.5: JP3.1 36.67,19.26 38.78,21.38 IC1.13
N$33  (via drill 0.5 pad 0.25)
  Top 0.5: v34.02,43.1 U4.3
  Bottom 0.5: JP5.1 42.21,48.7 38.62,45.1 34.82,45.1 34.77,45.05 34.72,45.05 34.12,44.45 34.12,43.2 v34.02,43.1
N$34  (via drill 0.5 pad 0.25)
  Top 0.5: v54.82,19.5 55.97,20.66 58.31,20.66 IC1.14
  Bottom 0.5: JP3.2 34.13,5.71 37.67,9.25 40.92,9.25 42.37,10.71 44.47,10.71 47.57,13.8 49.12,13.8 v54.82,19.5
N$35
  Top 0.5: JP3.3 31.59,7.07 35.47,10.96 35.47,19.61 37.92,22.05 58.36,22.05 IC1.12
N$36
  Top 0.5: R5.1 LED3.C
N$37
  Top 0.5: B1.~1 54.89,17.31 L5.2
N$38  (via drill 0.5 pad 0.25)
  Top 0.5: v35.37,43.91 U4.2
  Bottom 0.5: JP5.4 44.59,77.33 43.42,76.16 43.42,48.76 38.57,43.91 v35.37,43.91
N$39
  Top 0.5: U4.56 39.93,48.76 45.87,54.7 45.87,61.85 57.77,73.76 57.77,74.85 JP4.5
N$40  (via drill 0.5 pad 0.25)
  Top 0.5: C19.+ 72.58,25.56 73.27,26.25 L4.2 69.53,28.89 62.52,35.91 62.52,40.7 v64.77,42.95 | IC1.20 C19.+ | C19.+ 72.95,24.36 73,24.3 v75.62,24.3 | v59.67,45.41 C4.1 | R1.2 61.32,48.63 C5.1 v59.68,48.62 v59.67,48.6
  Bottom 0.5: JP1.1 73.76,4.54 80.07,10.86 80.07,21.8 77.62,24.25 75.67,24.25 v75.62,24.3 | v64.77,42.95 64.77,43.26 62.62,45.41 v59.67,45.41 v59.67,48.6
N$41  (via drill 0.5 pad 0.25)
  Top 0.5: U$1.15 19.54,13.42 v20.82,14.71 | U5.12 v69.97,67.31 | v35.37,36.05 35.37,36.01 35.27,35.91 U4.12 v25.82,35.91 v22.92,35.91 | 10.92,76.71 v10.85,76.63 U1.12 | v19.87,36.01 19.87,51.26 v10.77,60.35
  Bottom 0.5: v20.82,14.71 20.82,21 23.97,24.16 23.97,34.05 v25.82,35.91 | v69.97,67.31 64.02,67.31 35.37,38.66 v35.37,36.05 | v22.92,35.91 19.97,35.91 v19.87,36.01 | v10.77,60.35 10.77,76.46 v10.85,76.63
N$43
  pour Top: -1.18,81.41 83.42,81.41 83.42,-2.04 -1.43,-2.04 -1.43,-0.79 -1.43,81.21
N$44  (via drill 0.5 pad 0.25)
  Top 0.5: JP4.9 v62.87,73.41 | v58.97,73.41 58.97,66.03 41.55,48.6 41.55,46.34 U4.54
  Bottom 0.5: v62.87,73.41 v58.97,73.41
N$46  (via drill 0.5 pad 0.25)
  Top 0.5: C20.2 32.74,54.73 32.27,55.2 30.93,55.2 U3.14 U3.15 31.65,55.89 v31.97,56.2 | C21.2 31.72,61.45 | 31.72,61.45 33.31,61.45 L6.1 | v31.82,59.66 31.82,61.35 31.72,61.45
  Bottom 0.5: v31.97,56.2 31.97,59.51 v31.82,59.66
N$51  (via drill 0.5 pad 0.25)
  Top 0.5: U5.3 v80.27,67.31 | 29.72,35.09 29.59,35.09 29.27,35.06 29.27,32.66 v31.87,30.05 | 29.72,35.09 U4.13 | U$1.5 9.78,9.61 v9.82,9.65 | 31.82,30 v31.87,30.05 | v30.77,27.55 30.77,28.95 v31.87,30.05 | U1.3 10.85,69.03 v11.82,68.06 | v15.77,35.1 v18.97,35.1 | v23.72,35.1 29.69,35.1 29.72,35.09
  Bottom 0.5: v80.27,67.31 80.27,62.7 78.57,61.01 78.57,45.05 68.55,35.03 37.34,35.03 v31.87,30.05 | v9.82,9.65 17.62,9.65 22.27,14.3 22.27,19 29.62,26.36 | 29.62,26.36 29.67,26.41 | 29.62,26.36 v30.77,27.55 | v11.82,68.06 11.82,39.01 v15.77,35.1 | v18.97,35.1 v23.72,35.1
RESET  (via drill 0.5 pad 0.25)
  Top 0.5: S1.3 21.3,31.79 23.77,34.26 26.22,34.26 29.42,31.05 29.42,27.3 30.67,26.05 33.32,26.05 35.92,28.66 U4.20 35.92,34.26 36.67,35.01 v36.67,38.51 | 21.19,31.82 S1.3 | R6.1 21.14,25.22 S1.4 S1.3 | JP5.5 47.29,65.94 v47.32,65.91 | v48.27,53.76 v50.07,51.95
  Bottom 0.5: JP5.5 49.3,74.79 50.67,76.16 56.53,76.16 JP4.6 | v47.32,65.91 47.32,54.7 v48.27,53.76 | v50.07,51.95 50.07,51.91 v36.67,38.51
SCK  (via drill 0.5 pad 0.25)
  Top 0.5: U5.5 80.02,68.91 v80.62,69.51 | U4.11 v28.92,36.7 26.73,36.7 24.64,38.78 | 24.64,38.78 20.67,42.76 20.67,51.66 14.67,57.66 14.67,57.7 v12.62,59.76 | v12.57,69.96 12.42,70.11 12.42,71.94 U1.5 | JP5.3 44.75,63.09 v39.77,58.1 | U$1.16 16.79,30.92 24.64,38.78
  Bottom 0.5: v80.62,69.51 80.62,71.36 79.57,72.41 47.13,72.41 JP5.3 | v12.62,59.76 12.62,69.91 v12.57,69.96 | v39.77,58.1 39.82,58.3 28.07,46.51 28.07,37.55 v28.92,36.7
VCC  (via drill 0.5 pad 0.25)
  Top 0.5: 59.13,38.74 U$4.3 | C12.2 C2.1 C27.1 27.48,18.13 C26.1 | C26.1 27.48,21.11 C25.1 31.49,21.12 36.73,26.36 U4.21 36.73,33.91 37.52,34.7 37.52,44.8 37.62,44.91 | U5.14 74.17,64.79 C6.+ 63.82,60.16 63.42,60.55 63.42,62.73 L3.1 C18.1 61.31,71.62 60.33,72.61 JP4.7 59.05,76.16 56.52,76.16 55.27,77.41 JP4.4 | 59.47,27.2 58.41,27.2 IC1.4 58.39,27.2 60.02,27.2 | U$4.3 58.82,39.05 52.97,39.05 51.52,40.51 51.52,46.45 48.82,49.16 44.11,49.16 43.14,48.19 43.14,46.34 U4.52 43.12,45.51 42.52,44.91 37.62,44.91 | LED2.C 61.44,1.69 LED1.C v52.33,1.76 v52.32,1.75 | v60.07,23.45 60.02,23.45 60.02,27.2 | 60.02,27.2 60.02,30.41 59.02,31.41 59.02,33.91 | 59.02,33.91 59.02,38.58 U$4.3 | LED3.A 58.86,33.75 59.02,33.91 | U$1.6 6.08,8.34 v5.72,8.71 | v5.77,17.3 5.77,19.94 L1.1 11.7,20.33 v15.02,17 | v19.37,16.36 22.62,16.36 22.92,16.66 22.92,18.04 R6.2 24.14,18.12 v24.17,18.16 | v28.97,18.16 C26.1 | U1.14 5.13,74.97 2.52,72.36 2.52,64.21 4.42,62.3 5.49,62.3 | 5.49,62.3 L2.1 | 37.12,62.6 37.12,62.26 | 37.12,62.26 37.12,60.85 37.07,60.8 37.07,61.3 L6.2 | 5.49,62.3 6.87,62.3 v12.97,56.2 | v22.37,66.61 22.37,65.16 C10.1 36.49,65.14 37.12,64.51 37.12,62.6 | U4.64 33.53,45.35 | 33.53,45.35 33.97,44.91 37.62,44.91 | v35.92,51.3 35.96,51.35 C28.2 36.02,51.35 35.97,51.3 36.97,51.3 38.07,52.41 39.07,52.41 v39.97,53.3 | v31.82,47.26 31.82,47.05 33.53,45.35 | v40.52,62.55 37.42,62.55 37.12,62.26 | 37.12,62.6 37.17,62.55 | 37.17,62.55 37.22,62.51 37.22,62.6 37.17,62.55 | 37.17,62.55 v40.52,62.55 | v40.52,62.55 40.57,62.51 40.57,75.69 JP5.2
  Bottom 0.5: JP4.4 55.22,77.41 53.97,78.66 43.54,78.66 JP5.2 | v52.32,1.75 52.22,1.85 52.22,15.61 v60.07,23.45 | v5.72,8.71 5.72,17.25 v5.77,17.3 | v15.02,17 18.72,17 v19.37,16.36 | v24.17,18.16 v28.97,18.16 | v12.97,56.2 17.27,56.2 22.37,61.3 v22.37,66.61 | v35.92,51.3 35.87,51.3 v31.82,47.26 | v39.97,53.3 40.62,53.95 40.62,62.45 v40.52,62.55